# EAGLE design cyclo_no_flash (EAGLE 7.7.0)
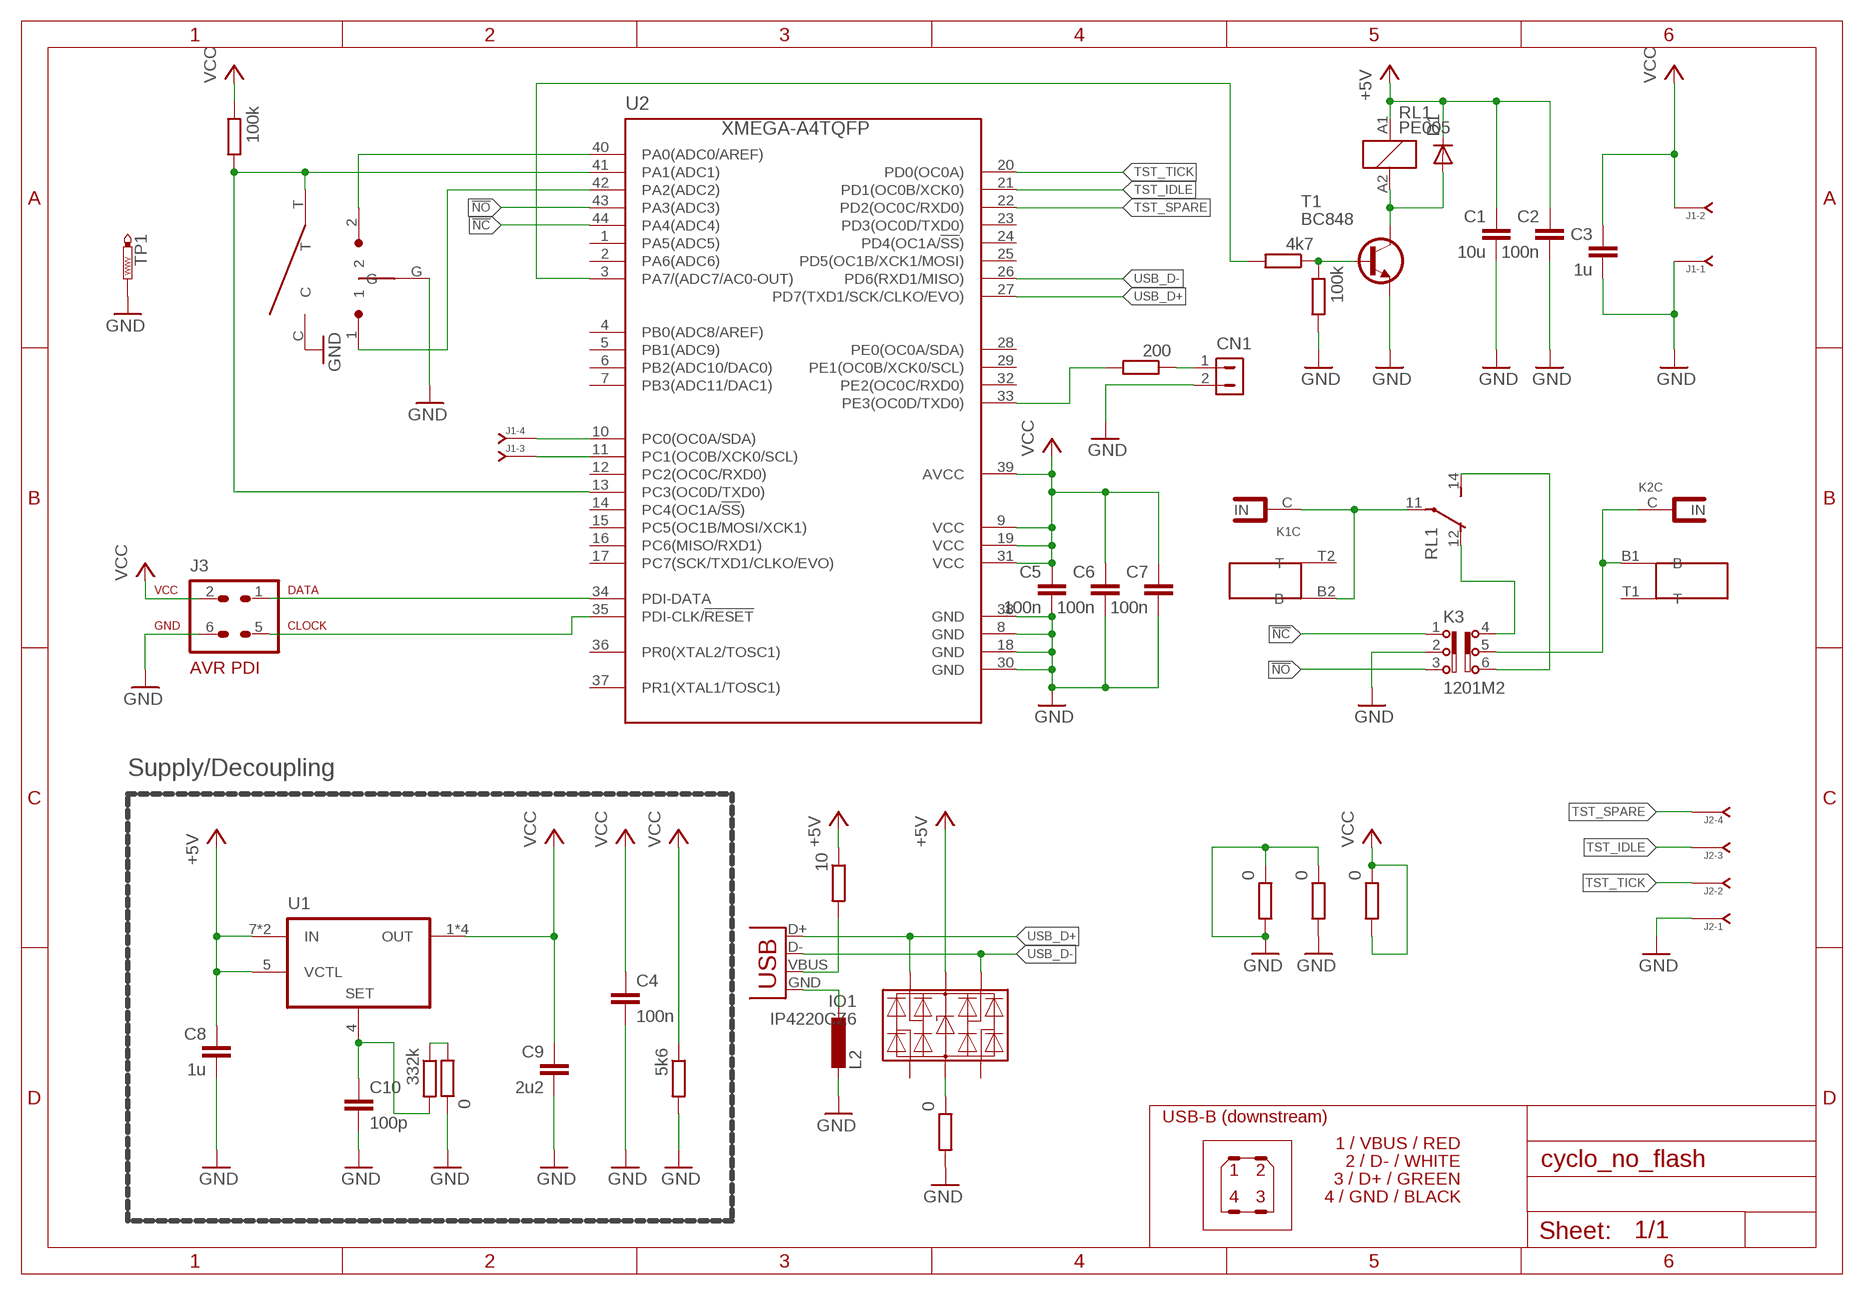
[diagram p0: schematic, sheet 1]

## Parts
C1  10u  C-EUC1210K  [C1210K]
C2  100n  C-EUC0603K  [C0603K]
C3  1u  C-EUC0603K  [C0603K]
C4  100n  C-EUC0603K  [C0603K]
C5  100n  C-EUC0603K  [C0603K]
C6  100n  C-EUC0603K  [C0603K]
C7  100n  C-EUC0603K  [C0603K]
C8  1u  C-EUC0805K  [C0805K]
C9  2u2  C-EUC0805K  [C0805K]
C10  100p  C-EUC0603K  [C0603K]
CN1  HDR-1X2-70543-?  [70543-02]
D1  DIODE-MINIMELF  [MINIMELF]
IO1  IP4220CZ6  [SOT23-6]
J1  J-04-SIP-100  [SIP-100-04]
J2  J-04-SIP-100  [SIP-100-04]
J3  AVR-PDIVERT  [AVR-ISP-6]
K1  S16N-PCK  [S16N-PC]
K2  S16N-PCK  [S16N-PC]
K3  1201M2  [1201M2]
L2  L-EUL2012C  [L2012C]
R1  4k7  R-EU_R0603  [R0603]
R2  0  R-EU_R0603  [R0603]
R3  332k  R-EU_R0603  [R0603]
R4  0  R-EU_R0603  [R0603]
R5  5k6  R-EU_R0603  [R0603]
R6  200  R-EU_R0603  [R0603]
R7  10  R-EU_R1210  [R1210]
R8  0  R-EU_R1206  [R1206]
R9  100k  R-EU_R0603  [R0603]
R10  100k  R-EU_R0603  [R0603]
R11  0  R-EU_R1206  [R1206]
R12  0  R-EU_R1206  [R1206]
RL1  PE005  [PE]
T1  BC848  [SOT23]
TP1  PTR1PAD1-17Y  [P1-17Y]
U1  LT3085  [MS8E]
U2  XMEGA-A4TQFP  [TQFP44]
U$1  H-MOLEX-2  [H-MOLEX2]
U$3  MCPL3BC-V  [MCPL3-BC-V]
X4  USB-B-H  [USB-B-H]

## Nets
!NC: K3.1 U2.44(PA4(ADC4))
!NO: K3.3 U2.43(PA3(ADC3))
+5V: C1.1 C2.1 C8.1 D1.C IO1.5(UCC) R7.1 RL1.A1 U1.5(VCTL) U1.7(IN) U1.8(IN)
GND: C1.2 C2.2 C3.2 C4.2 C5.2 C6.2 C7.2 C8.2 C9.2 C10.2 CN1.2 J1.1 J2.1 J3.6 K3.2 L2.2 R2.1 R4.2 R5.2 R8.1 R8.2 R10.2 R11.1 R11.2 T1.2(E) TP1.1(TP) U2.8(GND) U2.18(GND) U2.30(GND) U2.38(GND) U$3.C U$3.G
N$1: IO1.2(GND) R4.1
N$2: U2.40(PA0(ADC0/AREF)) U$3.2
N$3: R6.2 U2.33(PE3(OC0D/TXD0))
N$4: U2.42(PA2(ADC2)) U$3.1
N$5: R1.2 U2.3(PA7/(ADC7/AC0-OUT))
N$6: R1.1 R10.1 T1.1(B)
N$8 [power]: K3.4 RL1.12(2:O)
N$10 [power]: K1.C RL1.11(2:P) U$1.B2(2:B)
N$11 [power]: K3.6 RL1.14(2:S)
N$12 [power]: K2.C K3.5 U$1.B1(1:B)
N$13: R2.2 R3.1
N$15: D1.A RL1.A2 T1.3(C)
N$16: C10.1 R3.2 U1.4(SET)
N$17: CN1.1 R6.1
N$69: R7.2 X4.VBUS
N$70: J3.1 U2.34(PDI-DATA)
N$71: J3.5 U2.35(PDI-CLK/!RESET)
N$79: L2.1 X4.GND
PGM: R9.2 U2.13(PC3(OC0D/TXD0)) U2.41(PA1(ADC1)) U$3.T
SCL: J1.3 U2.11(PC1(OC0B/XCK0/SCL))
SDA: J1.4 U2.10(PC0(OC0A/SDA))
TST_IDLE: J2.3 U2.21(PD1(OC0B/XCK0))
TST_SPARE: J2.4 U2.22(PD2(OC0C/RXD0))
TST_TICK: J2.2 U2.20(PD0(OC0A))
USB_D+: IO1.3(B) U2.27(PD7(TXD1/SCK/CLKO/EVO)) X4.D+
USB_D-: IO1.1(A) U2.26(PD6(RXD1/MISO)) X4.D-
VCC: C3.1 C4.1 C5.1 C6.1 C7.1 C9.1 J1.2 J3.2 R5.1 R9.1 R12.1 R12.2 U1.1(OUT) U1.2(OUT) U1.3(OUT) U1.9(OUT) U2.9(VCC) U2.19(VCC) U2.31(VCC) U2.39(AVCC)
Unconnected: IO1.4(C) IO1.6(D) K1.1 K1.2 K1.3 K1.4 K2.1 K2.2 K2.3 K2.4 U2.1(PA5(ADC5)) U2.2(PA6(ADC6)) U2.4(PB0(ADC8/AREF)) U2.5(PB1(ADC9)) U2.6(PB2(ADC10/DAC0)) U2.7(PB3(ADC11/DAC1)) U2.12(PC2(OC0C/RXD0)) U2.14(PC4(OC1A/!SS!)) U2.15(PC5(OC1B/MOSI/XCK1)) U2.16(PC6(MISO/RXD1)) U2.17(PC7(SCK/TXD1/CLKO/EVO)) U2.23(PD3(OC0D/TXD0)) U2.24(PD4(OC1A/!SS!)) U2.25(PD5(OC1B/XCK1/MOSI)) U2.28(PE0(OC0A/SDA)) U2.29(PE1(OC0B/XCK0/SCL)) U2.32(PE2(OC0C/RXD0)) U2.36(PR0(XTAL2/TOSC1)) U2.37(PR1(XTAL1/TOSC1)) U$1.T1(1:T) U$1.T2(2:T)

## Notes on the sheet
- Supply/Decoupling
- USB-B (downstream)
- 1 / VBUS / RED
- 2 / D- / WHITE
- 1 | 2
- 3 / D+ / GREEN
- 4 | 3 | 4 / GND / BLACK

## Library data of the parts
C1-C10 = rcl:C-EU: CAPACITOR, European symbol
CN1 = con-hdrs40:HDR-1X2: HEADER CONNECTOR
D1 = diode:DIODE-: DIODE
IO1 = protection:IP4220CZ6: IP4220CZ6 Dual USB 2.0 Integrated ESD protection to IEC 61000-4-2 level 4 FEATURES > ESD IEC 61000-4-2 level 4, ± 8kV contact discharge compliant protection > Four ultra-low input capacitance (1 pF typ.) ESD rail-to-rail protection diodes > Low voltage clamping due to integrated Zener diode > Small 6 lead SO6 (SOT457) package APPLICATIONS General-purpose downstream ESD protection high frequency analog signals and high-speed serial data transmission for ports inside: > Cellular and PCS mobile handsets > PC-/Notebook USB2.0/IEEE1394 ports > DVI interfaces > Cordless telephones > Wireless data (WAN/LAN) systems > PDAs; MPN: IP4220CZ6; OC_FARNELL: 1506629; PACKAGE: SOT-457; SUPPLIER: NXP
J1 J2 = con-headers-jp:J-04-: HEADER JACK PINS
J3 = avr-7:AVR-PDI: AVR PDI programming interface connector
K1 K2 = connectors:S16N-PC
K3 = switch-ck:1201M2
L2 = rcl:L-EU: INDUCTOR, European symbol
R1-R12 = rcl:R-EU_: RESISTOR, European symbol
RL1 = relay:PE*: Miniature PCB Relay 1 pole 5 A SCHRACK Source: http://www.schrack.com/.. 5807.pdf Miniature PCB Relay bistable 1pole 5 A, polarized bistable version Source: http://www.schrack.com/.. 5808.pdf
T1 = transistor:BC848: NPN TRANSISTOR
TP1 = testpad:PTR1: TEST PIN
U1 = linear-technology:LT3085
U2 = avr-7:XMEGA-A4: Atmel XMega A4 series processor
U$1 = connectors:H-MOLEX-2
U$3 = multicomp:MCPL3
X4 = con-usb:USB: USB Connectors

## Net classes
0 default: width 0.254 mm, drill 0.5 mm, clearance 0.203 mm
1 power: width 1.27 mm, clearance 0.203 mm

## Board
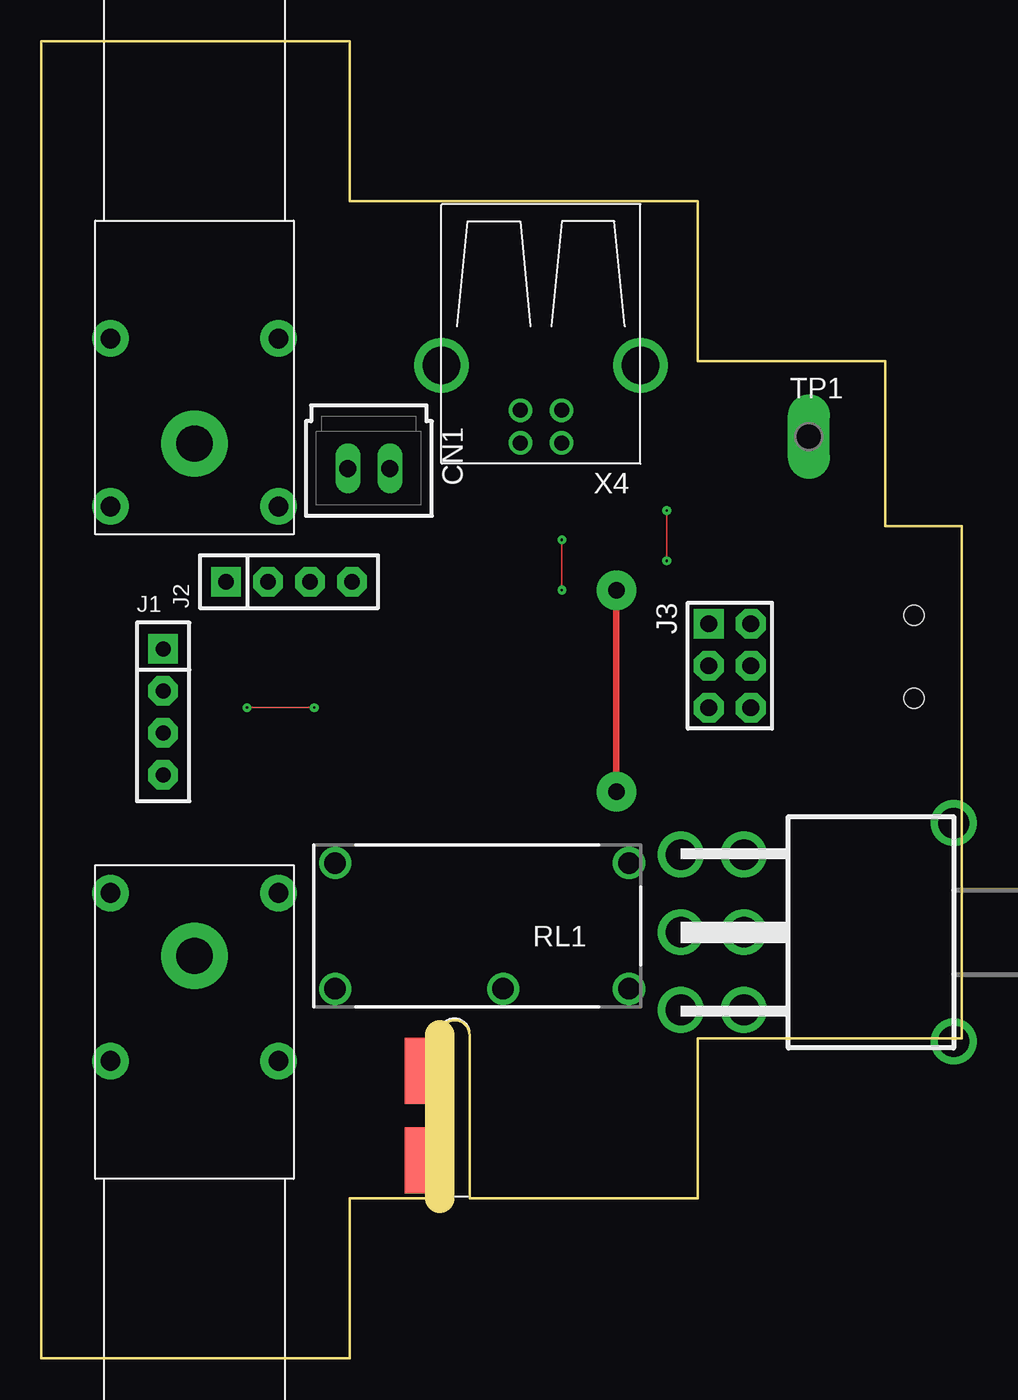
[diagram p1: board, top side]
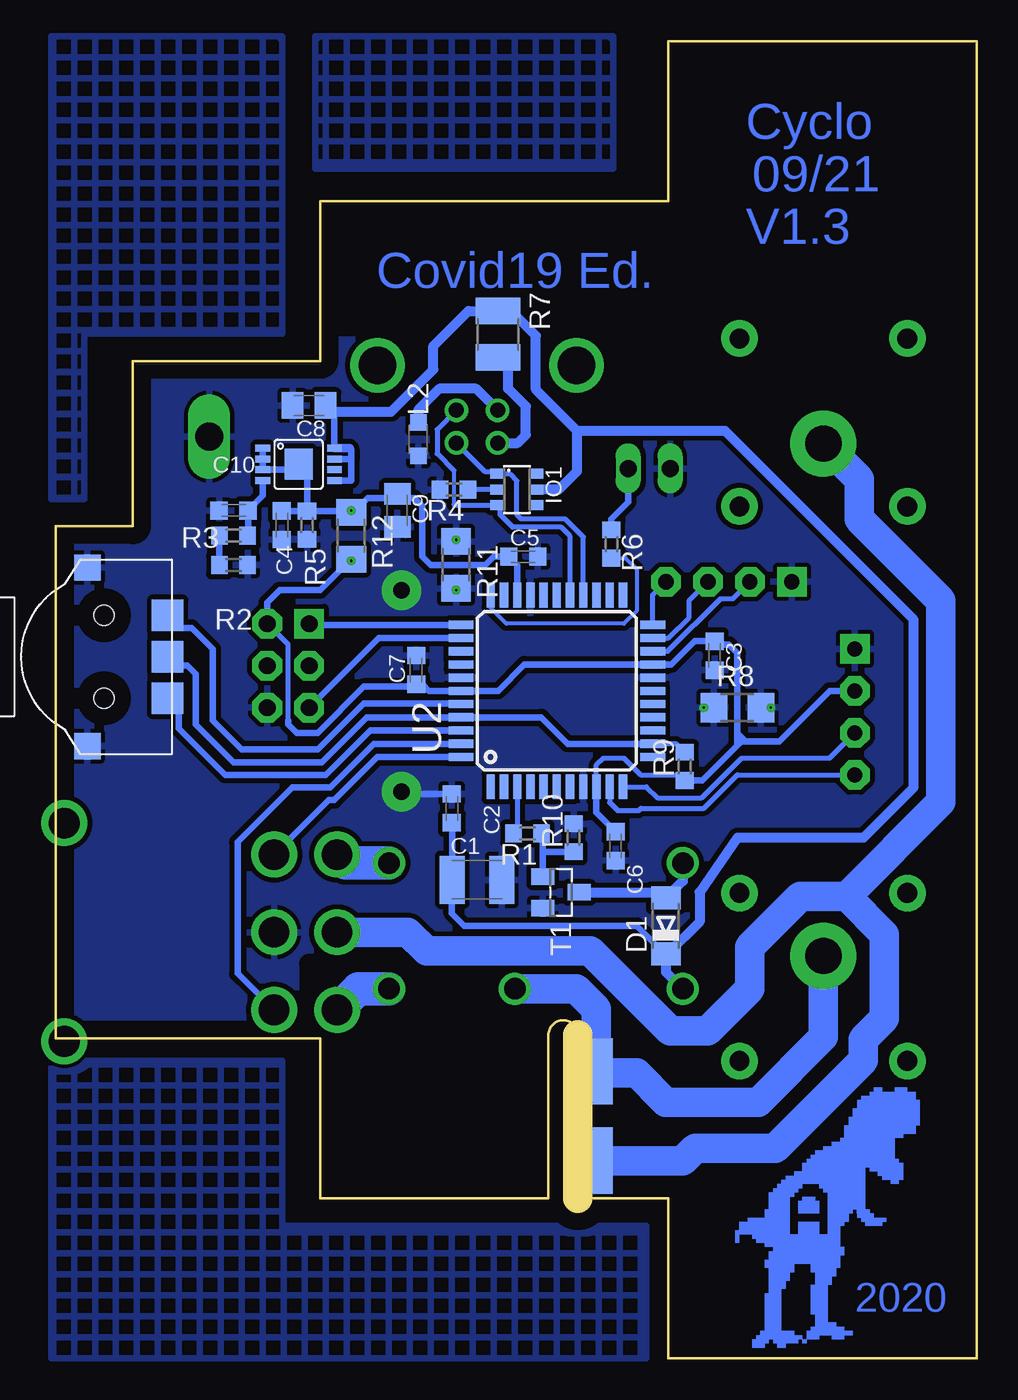
[diagram p2: board, bottom side, seen from below]

Size 55.7 x 79.7 mm. Coordinates in mm from the lower left corner, seen from the top.
Outline: 39.7,9.68 39.7,19.35 55.7,19.35 55.7,50.35 51.05,50.35 51.05,60.35 39.7,60.35 39.7,70.03 18.65,70.03 18.65,79.7 0,79.7 0,0 18.65,0 18.65,9.67 24.12,9.67 24.12,19.58
Outline: 25.92,19.58 25.92,9.67 39.7,9.67
Outline: 24.13,19.56 arc-180 25.91,19.56
Copper layers (1*16): Top 0.035mm / dielectric 1.5mm / Bottom 0.035mm
Design rules "default": minimum track width 10mil, minimum drill 24mil, track to track 8mil, track to pad 8mil, pad to pad 8mil, via to via 8mil, smd to smd 8mil, copper to edge 40mil, drill to drill 8mil, minimum pad ring 10mil, minimum via ring 8mil, stop-mask expansion 4mil, vias tented up to drill 0mil, thermal gap 10mil
bRestrict: area 0,0 to 17.8,17.8; area 1.4,58.5 to 39.2,77.5; area 26.2,9.7 to 40.4,23.9

### Footprints (pad centres in the part's own frame; a part is rotated, then mirrored left to right if it is on the bottom)
C1210K = smd 1.5 x 2.9: 1 -1.5,0; 2 1.5,0
C0603K = smd 1.05 x 1.08: 1 -0.875,0; 2 0.875,0
C0805K = smd 1.3 x 1.6: 1 -1,0; 2 1,0
70543-02 = drill 1.016 long: 1 -1.27,0; 2 1.27,0
MINIMELF = smd 1.4 x 1.8: A 1.7,0; C -1.7,0
SOT23-6 = smd 0.6 x 0.9: 1 -0.95,-1.15; 2 0,-1.15; 3 0.95,-1.15; 4 0.95,1.15; 5 0,1.15; 6 -0.95,1.15
SIP-100-04 = drill 0.914 pad 1.778 square: 1 -3.81,0 | drill 0.914 pad 1.778 octagon: 2 -1.27,0; 3 1.27,0; 4 3.81,0
AVR-ISP-6 = drill 1.016 pad 1.8 square: 1 -2.54,-1.27 | drill 1.016 pad 1.8 octagon: 2 -2.54,1.27; 3 0,-1.27; 4 0,1.27; 5 2.54,-1.27; 6 2.54,1.27
S16N-PC = drill 1.2 pad 2.2: 1 -6.36,5.08; 2 3.8,5.08; 3 3.8,-5.08; 4 -6.36,-5.08 | drill 2.2 pad 4: C 0,0
1201M2 = drill 1.85: 1 4.7,0; 2 0,0; 3 -4.7,0; 4 4.7,3.81; 5 0,3.81; 6 -4.7,3.81; S@@1 -6.605,-12.7; S@@2 6.605,-12.7
L2012C = smd 1 x 1: 1 -1,0; 2 1,0
R0603 = smd 1 x 1.1: 1 -0.85,0; 2 0.85,0
R1210 = smd 1.6 x 2.7: 1 -1.4,0; 2 1.4,0
R1206 = smd 1.6 x 1.803: 1 -1.422,0; 2 1.422,0
PE = drill 1.3: 11 -1.27,3.81; 12 -8.89,-3.81; 14 -8.89,3.81; A1 8.89,3.81; A2 8.89,-3.81
SOT23 = smd 1 x 1.4: 1 -0.95,-1.1; 2 0.95,-1.1; 3 0,1.1
P1-17Y = drill 1.702 pad 2.121 long: 1 0,0
MS8E = smd 0.42 x 0.889: 1 -0.975,-2.17; 2 -0.325,-2.17; 3 0.325,-2.17; 4 0.975,-2.17; 5 0.975,2.17; 6 0.325,2.17; 7 -0.325,2.17; 8 -0.975,2.17 | smd 1.88 x 1.68: 9 0,0
TQFP44 = smd 1.5 x 0.5: 1 -5.8,4; 2 -5.8,3.2; 3 -5.8,2.4; 4 -5.8,1.6; 5 -5.8,0.8; 6 -5.8,0; 7 -5.8,-0.8; 8 -5.8,-1.6; 9 -5.8,-2.4; 10 -5.8,-3.2; 11 -5.8,-4; 23 5.8,-4; 24 5.8,-3.2; 25 5.8,-2.4; 26 5.8,-1.6; 27 5.8,-0.8; 28 5.8,0; 29 5.8,0.8; 30 5.8,1.6; 31 5.8,2.4; 32 5.8,3.2; 33 5.8,4 | smd 0.5 x 1.5: 12 -4,-5.8; 13 -3.2,-5.8; 14 -2.4,-5.8; 15 -1.6,-5.8; 16 -0.8,-5.8; 17 0,-5.8; 18 0.8,-5.8; 19 1.6,-5.8; 20 2.4,-5.8; 21 3.2,-5.8; 22 4,-5.8; 34 4,5.8; 35 3.2,5.8; 36 2.4,5.8; 37 1.6,5.8; 38 0.8,5.8; 39 0,5.8; 40 -0.8,5.8; 41 -1.6,5.8; 42 -2.4,5.8; 43 -3.2,5.8; 44 -4,5.8
H-MOLEX2 = smd 2 x 4 bottom: B1 -1.07,2.18; B2 -1.07,7.58 | smd 2 x 4: T1 -1.1,2.2; T2 -1.1,7.6
MCPL3-BC-V = smd 1.9 x 1.9: 1 -2.5,-3.85; 2 2.5,-3.85; T 0,-3.85 | smd 1.6 x 1.6: C 5.4,1; G -5.4,1 | hole 1.2: -2.5,0; 2.5,0
USB-B-H = drill 0.914: D+ 0,1.25; D- 1.981,1.25; GND 0,-1.25; VBUS 1.981,-1.25 | drill 2.286: P$1 -2.718,-6.02; P$2 -2.718,6.02

### Placement (x,y rotation side)
C1  30.23,28.96 0 bottom
C2  31.75,33.27 90 bottom
C3  15.85,42.52 270 bottom
C4  42.04,50.42 270 bottom
C5  27.43,48.51 0 bottom
C6  21.84,30.99 270 bottom
C7  33.91,41.66 90 bottom
C8  40.39,57.66 180 bottom
C9  35.05,51.31 270 bottom
C10  44.96,51.31 180 bottom
CN1  19.81,53.85 180 top
D1  18.8,26.16 90 bottom
IO1  27.81,52.58 270 bottom
J1  7.37,39.12 270 top
J2  14.99,46.99 0 top
J3  41.66,41.91 270 top
K1  9.27,24.35 90 top
K2  9.27,55.35 270 top
K3  42.5,25.78 90 top
L2  33.78,55.63 270 bottom
R1  27.18,31.75 180 bottom
R2  44.96,48.01 180 bottom
R3  44.96,49.78 0 bottom
R4  31.62,52.58 180 bottom
R5  40.51,50.42 270 bottom
R6  22.1,49.28 270 bottom
R7  28.96,61.98 270 bottom
R8  14.48,39.37 0 bottom
R9  17.65,35.81 90 bottom
R10  24.38,31.5 90 bottom
R11  31.5,48.01 270 bottom
R12  37.85,49.78 270 bottom
RL1  26.67,26.16 180 top
T1  25.15,28.19 270 bottom
TP1  46.43,55.78 0 top
U1  41.02,54.1 270 bottom
U2  25.4,40.39 90 bottom
U$1  24.09,9.78 0 top
U$3  52.8,42.45 90 bottom
X4  30.23,57.37 270 top

### Tracks (layer width: path | path; a pad name or v marks a point on that pad's centre or on a via)
!NC
  Bottom 0.406: K3.1 39.2,33.78 38.86,33.78 36.26,36.39 U2.44
!NO
  Bottom 0.406: K3.3 44.49,23.07 44.7,23.28 44.7,31.24 41.4,34.54 39.12,34.54 36.47,37.19 U2.43
+5V
  Bottom 0.406: D1.C 18.87,24.46 20.57,26.16 30.99,26.16 31.75,26.92 31.75,28.4 31.73,28.42 C1.1 | C1.1 31.5,28.73 | U1.5 37.85,53.13 37.85,54.36 | U1.7 37.92,54.43 37.85,54.36 | 37.93,55.08 37.85,54.99 37.85,54.36 | C8.1 39,57.66 39,57.27 | 38.85,57.12 U1.8 | C1.1 31.73,32.38 C2.1
  Bottom 0.508: 38.85,57.12 39,57.27 | U1.8 37.93,55.08
  Bottom 0.61: IO1.5 25.27,52.58 24.18,53.67 24.18,56.13 | 24.18,56.13 15.24,56.13 3.81,44.7 3.81,34.54 6.86,31.5 14.48,31.5 16.76,28.19 16.76,26.42 18.72,24.46 D1.C 18.8,23.37 RL1.A1 17.53,22.35 | 39,57.27 35.44,57.27 32.87,59.84 32.87,61.27 30.76,63.38 R7.1 28.17,63.38 26.67,61.87 26.67,58.62 24.18,56.13
GND  (via drill 0.13, 1 pad 2.4)
  Top 0.102: v12.45,39.37 v16.51,39.37 | v31.5,49.53 v31.5,46.48
  Top 0.406: v34.8,34.29 v34.8,46.48
  Bottom 0.102: R11.1 v31.5,49.53 | 31.5,46.74 R11.2
  Bottom 0.305: 19.56,41.15 U2.18 | 34.54,49.78 35.05,50.29 C9.2
  Bottom 0.406: C2.2 34.66,34.15 v34.8,34.29 | v34.8,46.48 34.8,46.99
  pour Bottom (isolate 0.305, rank 2): -1.78,81.28 57.91,81.53 57.91,-2.29 -1.78,-2.54
N$1
  Bottom 0.305: IO1.2 R4.1
N$2
  Bottom 0.305: 48.95,44.89 U$3.2 48.76,44.95 | 31.24,39.62 U2.40
  Bottom 0.406: 31.24,39.62 37.08,39.62 39.88,36.83 44.45,36.83 46.23,38.61 46.23,42.93 47.5,44.2 48.2,44.2 U$3.2
N$3
  Bottom 0.254: U2.33 29.4,45.4 28.45,44.45 21.34,44.45 20.57,45.21 20.57,47.75 21.25,48.43 R6.2
N$4
  Bottom 0.305: 48.26,39.88 48.33,39.95 U$3.1
  Bottom 0.406: U2.42 36.69,37.99 39.37,35.31 45.47,35.31 48.26,38.1 48.26,39.88
N$5
  Bottom 0.305: U2.3 27.8,31.98 R1.2
N$6
  Bottom 0.305: 26.25,31.67 R1.1
  Bottom 0.406: 25.97,29.14 T1.1 26.25,30.65 | R10.1 26.25,30.65 | 26.25,31.67 26.25,30.65
N$7
  pour Bottom (hatched): 22,80 40,80 40,72 22,72
N$8
  Bottom 2.032: RL1.12 38.18,29.97 K3.4
N$9
  pour Bottom (hatched): 42,80 56,80 56,52 54,52 54,62 42,62
N$10
  Bottom 1.778: RL1.11 24.22,22.35 23.02,21.16 U$1.B2 22.94,17.27 20.57,17.27 18.8,15.49 13.21,15.49 9.27,19.43 K1.C
N$11
  Bottom 2.032: RL1.14 37.42,22.35 K3.6
N$12
  Bottom 1.27: 2.03,33.78 2.16,33.66 | 9.27,55.37 K2.C
  Bottom 1.778: K3.5 34.42,25.78 33.27,24.64 23.37,24.64 18.54,19.81 16.26,19.81 13.72,22.35 13.72,24.89 10.67,27.94 7.87,27.94 | 7.87,27.94 2.16,33.66 2.16,45.85 7.11,50.8 7.11,53.21 9.27,55.37 | U$1.B1 23,11.94 17.78,11.94 17.02,12.7 12.19,12.7 6.86,18.03 6.86,19.3 5.59,20.57 5.59,25.65 7.87,27.94
N$13
  Bottom 0.4: R3.1 R2.2
N$14
  pour Bottom (hatched): 20,0 20,8 42,8 42,18 56,18 56,0
N$15
  Bottom 0.61: T1.3 19.13,28.19 D1.A 17.78,28.88 RL1.A2
N$16
  Bottom 0.406: U1.4 43.19,52.2 C10.1 44.08,49.81 R3.2
N$17
  Bottom 0.406: R6.1 22.1,50.8 21.08,51.82 CN1.1
N$69
  Bottom 0.61: X4.VBUS 27.77,55.39 27.28,55.88 27.28,57.61 28.35,58.67 28.35,59.97 R7.2
N$70
  Bottom 0.406: U2.34 40.32,44.39 J3.1
N$71
  Bottom 0.406: U2.35 36.17,43.59 J3.5
N$79
  Bottom 0.61: X4.GND 30.28,58.67 32.51,58.67 33.78,57.4 L2.1
PGM
  Bottom 0.305: R9.2 18.18,37.19 U2.13 | 48.8,42.45 U$3.T
  Bottom 0.406: U$3.T 48.41,41.91 47.75,41.91 47.24,41.4 47.24,38.35 44.96,36.07 39.62,36.07 36.91,38.79 U2.41 26.34,38.79 24.74,37.19 U2.13
SCL
  Bottom 0.305: U2.11 19.98,34.59 19.3,33.91 16.64,33.91 14.22,36.32 8.89,36.32 J1.3
SDA
  Bottom 0.305: U2.10 22.2,33.63 21.72,33.15 20.45,33.15 20.32,33.27 16.51,33.27 14.48,35.31 J1.4
TST_IDLE
  Bottom 0.305: U2.21 18.64,43.59 17.4,44.83 17.4,45.85 J2.3
TST_SPARE
  Bottom 0.305: U2.22 19.6,46.19 J2.4
TST_TICK
  Bottom 0.305: U2.20 18.68,42.79 15.49,45.97 14.73,45.97 J2.2
USB_D+
  Bottom 0.254: 31.62,53.72 31.62,51.69
  Bottom 0.305: U2.27 24.6,49.75 25.15,50.29 28.07,50.29 28.83,51.05 28.83,51.49 IO1.3 | IO1.3 28.89,51.63 | X4.D+ 32.64,56.21 32.64,54.74 31.62,53.72 | 31.62,51.69 31.56,51.63 IO1.3
USB_D-
  Bottom 0.305: U2.26 23.8,49.71 24.89,50.8 27.56,50.8 27.81,51.05 27.81,53.09 28.25,53.53 IO1.1 29.07,53.63 29.72,53.63 X4.D-
VCC  (via drill 0.13)
  Top 0.102: v37.85,48.26 R12.1 v37.85,51.31
  Bottom 0.102: R12.1 v37.85,51.31 | v37.85,48.26 R12.2
  Bottom 0.305: 34.82,52.35 34.82,52.79 C9.1 | U2.9 23,35.93 22.61,36.32 21.34,36.32 20.32,35.31 18,35.31 R9.1 | 33.13,40.39 33.39,40.64 | 41.66,38.61 41.66,43.18 J3.2
  Bottom 0.406: C5.1 27.8,48.01 U2.31 27.84,46.23 | C7.1 33.13,40.39 U2.39 28.96,40.39 27.36,41.99 U2.19 18.47,41.99 17.06,43.4 C3.1 15.63,43.18 14.99,43.18 14.48,42.67 14.48,37.85 | U1.1 U1.2 U1.3 41.46,53.78 41.4,53.72 U1.9 40.51,54.1 R5.1 | R5.1 42.01,51.27 C4.1 | 40.22,51.56 R5.1 | J3.2 42.93,45.72 42.16,46.48 39.73,46.48 R12.2 | 33.39,40.64 37.08,40.64 39.88,37.85 41.15,37.85 41.66,38.35 41.66,38.61 | 28.56,48.26 C5.1 | U2.9 23,33.02 C6.1 | R9.1 16.6,34.96 14.48,37.08 | 14.48,37.08 14.48,37.85 | J1.2 8.89,40.39 11.94,37.34 13.97,37.34 | 13.97,37.34 14.22,37.34 14.48,37.08 | 13.97,37.34 14.48,37.85 | C5.1 29.21,48.51 29.72,48.01 33.02,48.01 33.53,48.51 33.53,51.56 34.04,52.07 34.81,52.07 C9.1 35.29,52.07 36.83,52.07 37.69,51.21 R12.1 37.91,51.27 R5.1
(copper drawn outside any net)
  shapes: Bottom area x114

### Text on the board
Bottom: Cyclo | 09/21 | V1.3 | Covid19 Ed. | 2020
bStop: 2020